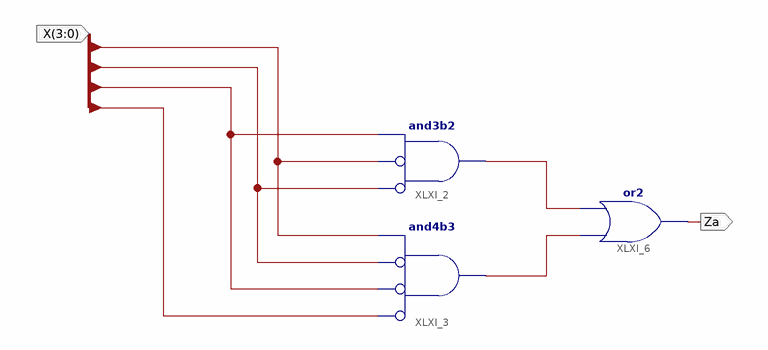
[diagram p0: schematic sheet 1]
// Xilinx ISE schematic a.sch (spartan3e) as structural Verilog: 3 symbols, 2 ports
module a (
  input  [3:0] X,
  output Za
);

  wire XLXN_14, XLXN_15;

  and XLXI_2 (XLXN_14, ~X[1], ~X[0], X[2]);  // and3b2
  and XLXI_3 (XLXN_15, ~X[3], ~X[2], ~X[1], X[0]);  // and4b3
  or XLXI_6 (Za, XLXN_15, XLXN_14);
endmodule
